# Altium schematic sheet Sheet1.SchDoc
size A4; SheetNumber: 1; SheetTotal: 1
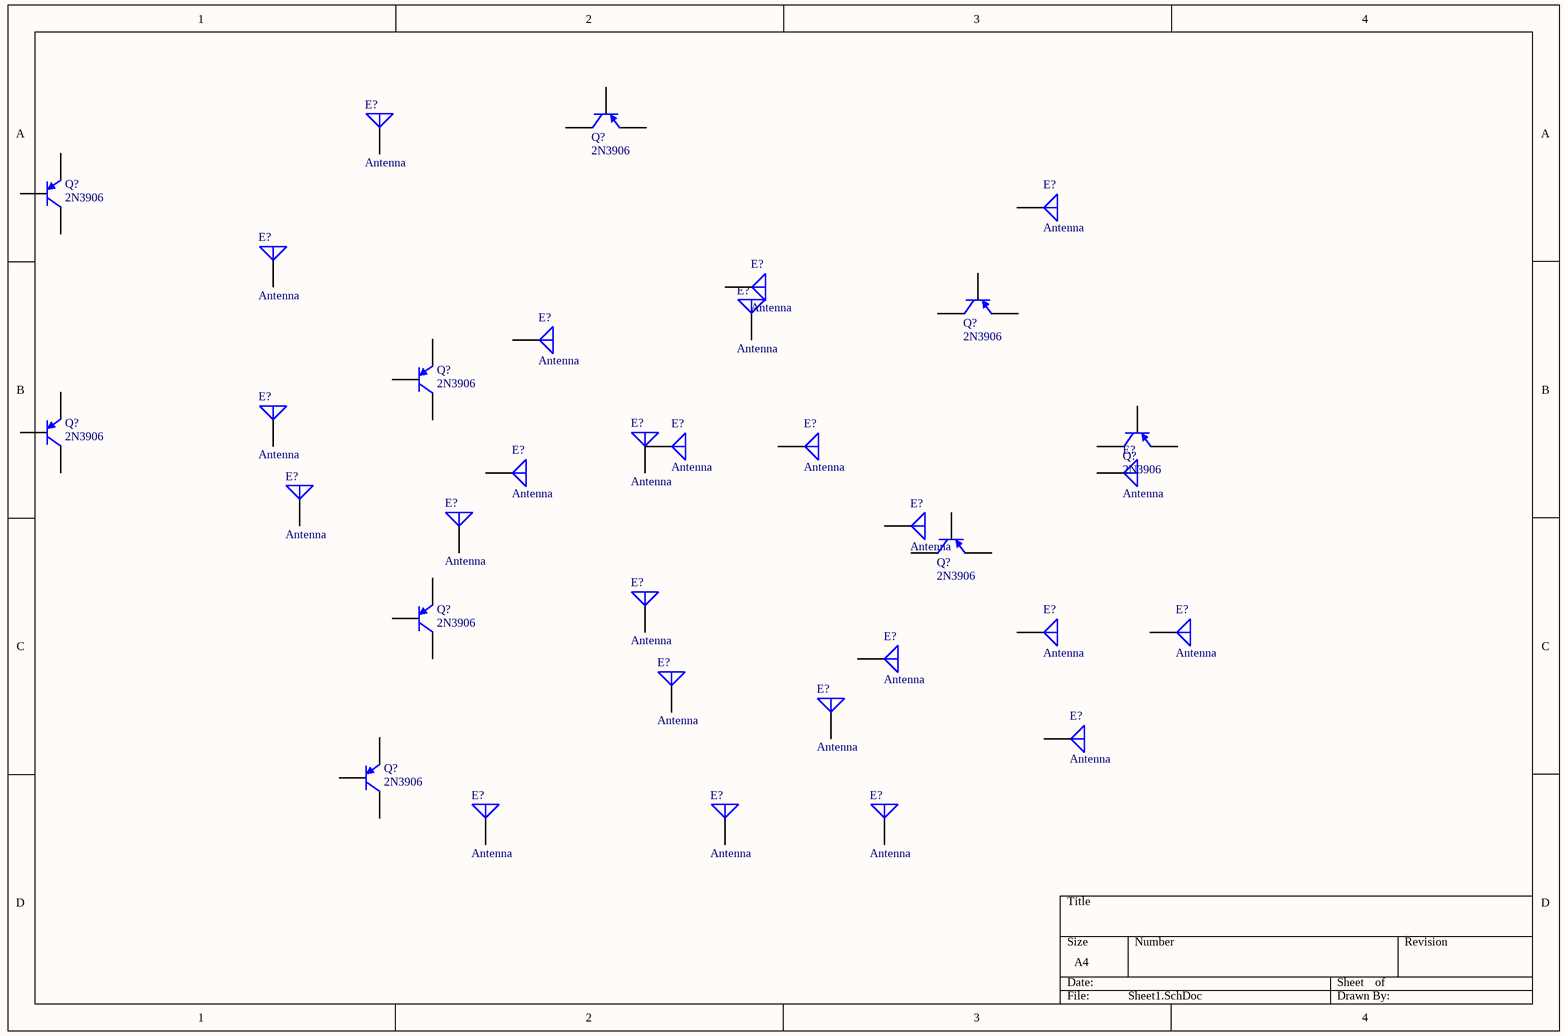
[diagram p0: Sheet1.SchDoc]

## Parts
(Parts that share a designator on the sheet are numbered #1, #2 ... from top to bottom, then left to right.)
E?#1  Antenna  [PIN1]
E?#2  Antenna  [PIN1]
E?#3  Antenna  [PIN1]
E?#4  Antenna  [PIN1]
E?#5  Antenna  [PIN1]
E?#6  Antenna  [PIN1]
E?#7  Antenna  [PIN1]
E?#8  Antenna  [PIN1]
E?#9  Antenna  [PIN1]
E?#10  Antenna  [PIN1]
E?#11  Antenna  [PIN1]
E?#12  Antenna  [PIN1]
E?#13  Antenna  [PIN1]
E?#14  Antenna  [PIN1]
E?#15  Antenna  [PIN1]
E?#16  Antenna  [PIN1]
E?#17  Antenna  [PIN1]
E?#18  Antenna  [PIN1]
E?#19  Antenna  [PIN1]
E?#20  Antenna  [PIN1]
E?#21  Antenna  [PIN1]
E?#22  Antenna  [PIN1]
E?#23  Antenna  [PIN1]
E?#24  Antenna  [PIN1]
E?#25  Antenna  [PIN1]
Q?#1  2N3906  [TO-92A]
Q?#2  2N3906  [TO-92A]
Q?#3  2N3906  [TO-92A]
Q?#4  2N3906  [TO-92A]
Q?#5  2N3906  [TO-92A]
Q?#6  2N3906  [TO-92A]
Q?#7  2N3906  [TO-92A]
Q?#8  2N3906  [TO-92A]
Q?#9  2N3906  [TO-92A]

## Nets

Not connected (* = marked no-connect by the designer): E?#1 1(A); E?#2 1(A); E?#3 1(A); E?#4 1(A); E?#5 1(A); E?#6 1(A); E?#7 1(A); E?#8 1(A); E?#9 1(A); E?#10 1(A); E?#11 1(A); E?#12 1(A); E?#13 1(A); E?#14 1(A); E?#15 1(A); E?#16 1(A); E?#17 1(A); E?#18 1(A); E?#19 1(A); E?#20 1(A); E?#21 1(A); E?#22 1(A); E?#23 1(A); E?#24 1(A); E?#25 1(A); Q?#1 1(E) 2(B) 3(C); Q?#2 1(E) 2(B) 3(C); Q?#3 1(E) 2(B) 3(C); Q?#4 1(E) 2(B) 3(C); Q?#5 1(E) 2(B) 3(C); Q?#6 1(E) 2(B) 3(C); Q?#7 1(E) 2(B) 3(C); Q?#8 1(E) 2(B) 3(C); Q?#9 1(E) 2(B) 3(C)

## Library data of the parts
E?#1-E?#25 = Antenna: Generic Antenna; Published: 24-Mar-1999; LatestRevisionDate: 17-Jul-2002; LatestRevisionNote: Re-released for DXP Platform.; PackageReference: PIN1; Publisher: Altium Limited
Q?#1-Q?#9 = 2N3906: PNP General Purpose Amplifier; Published: 8-Jun-2000; LatestRevisionDate: 15-Jan-2003; LatestRevisionNote: PCB Footprint 'BCY-W3/D4.7' replaced; DatasheetVersion: 1997; PackageVersion: Sep-1998; PackageReference: TO-92A; Publisher: Altium Limited; PackageDescription: TO, Flat Index; 3 In-Line, Axial Leads; Body Dia. 4.5mm; Leads 0.51 x 0.48 mm (max); ComponentLink1Description: Manufacturer Link; ComponentLink1URL: http://www.fairchildsemi.com/; ComponentLink2Description: Datasheet; ComponentLink2URL: http://www.fairchildsemi.com/ds/2N%2F2N3906.pdf